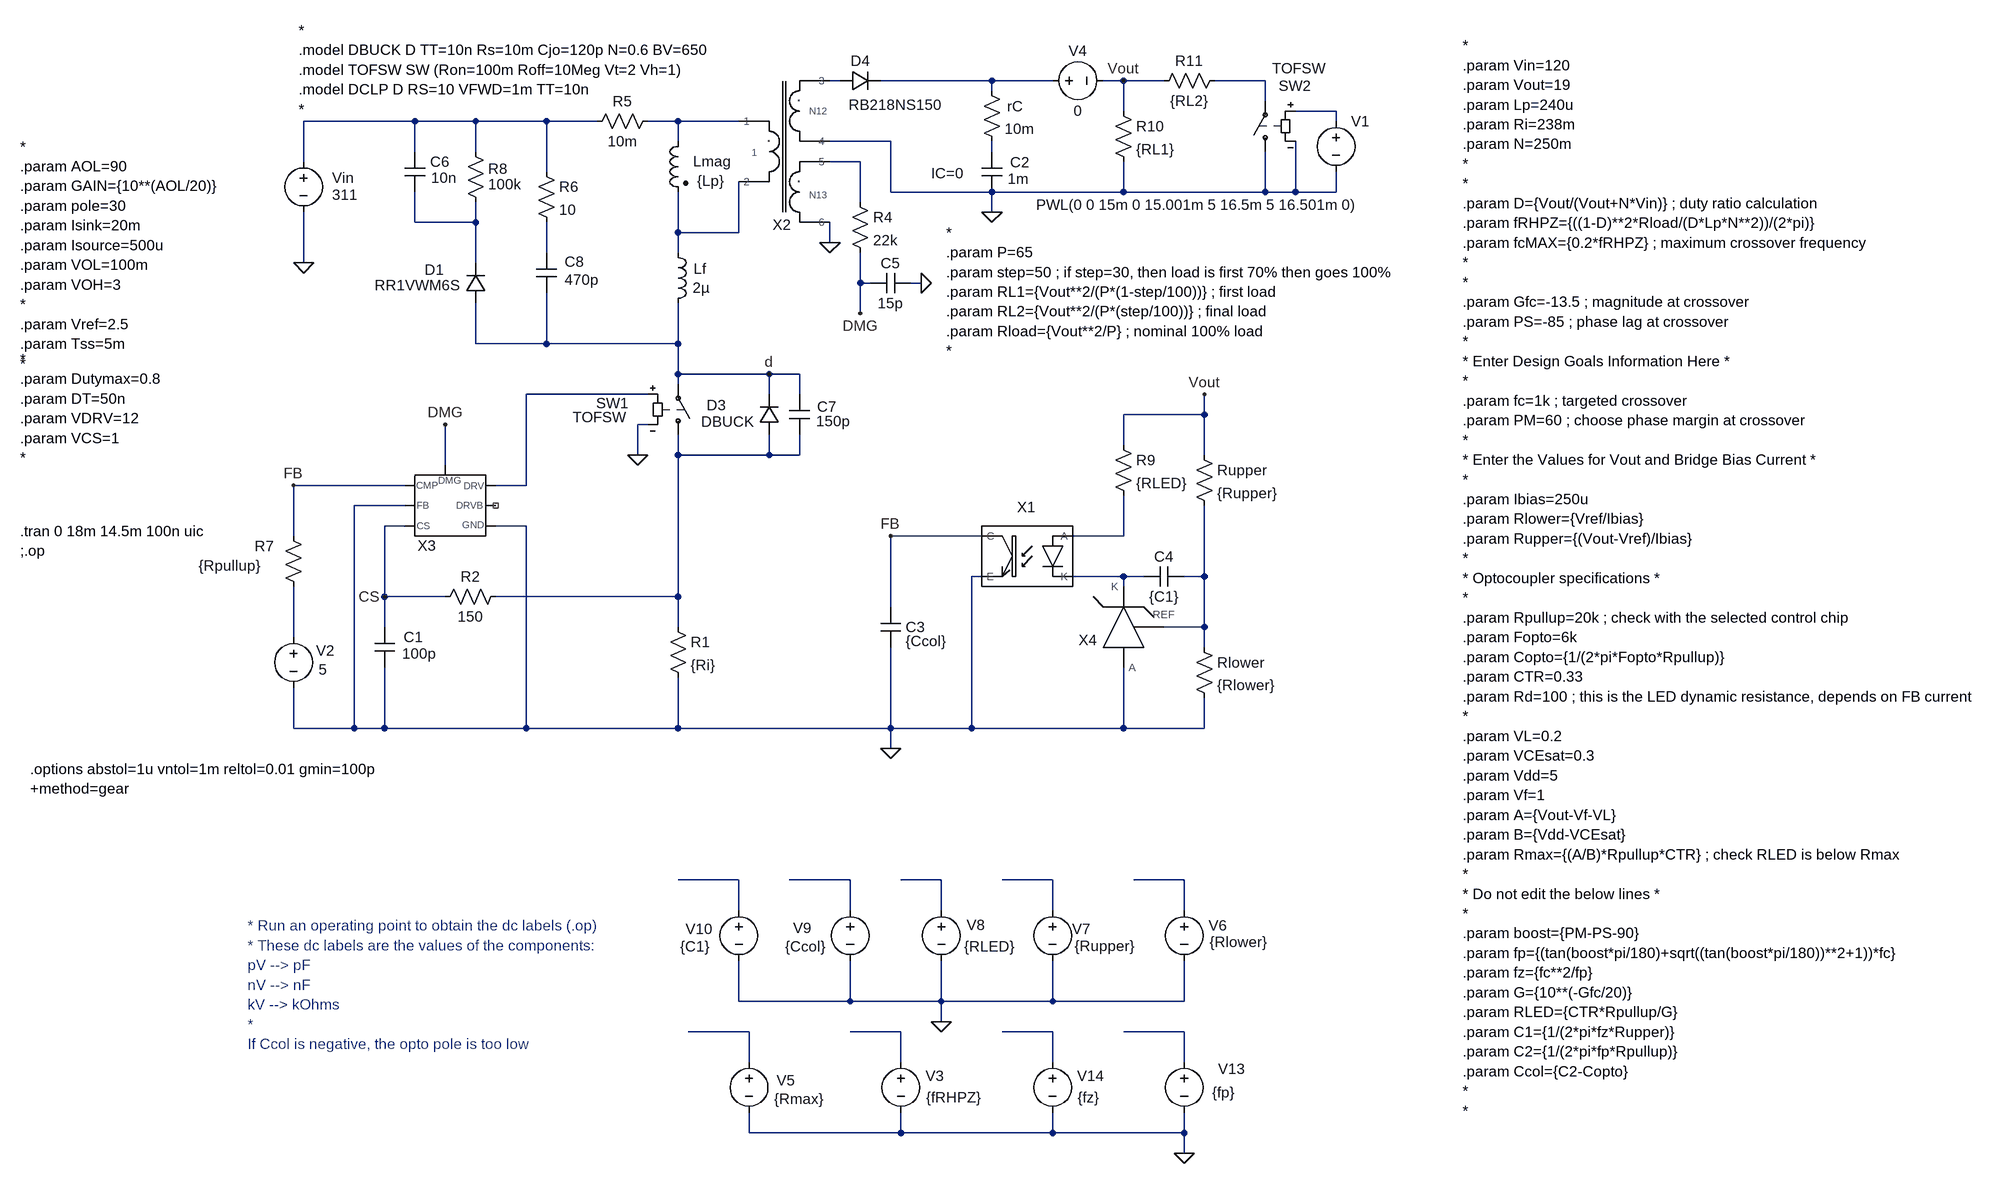
[diagram p0: schematic Flyback CM - QR - isolated - cbc - load step.asc]
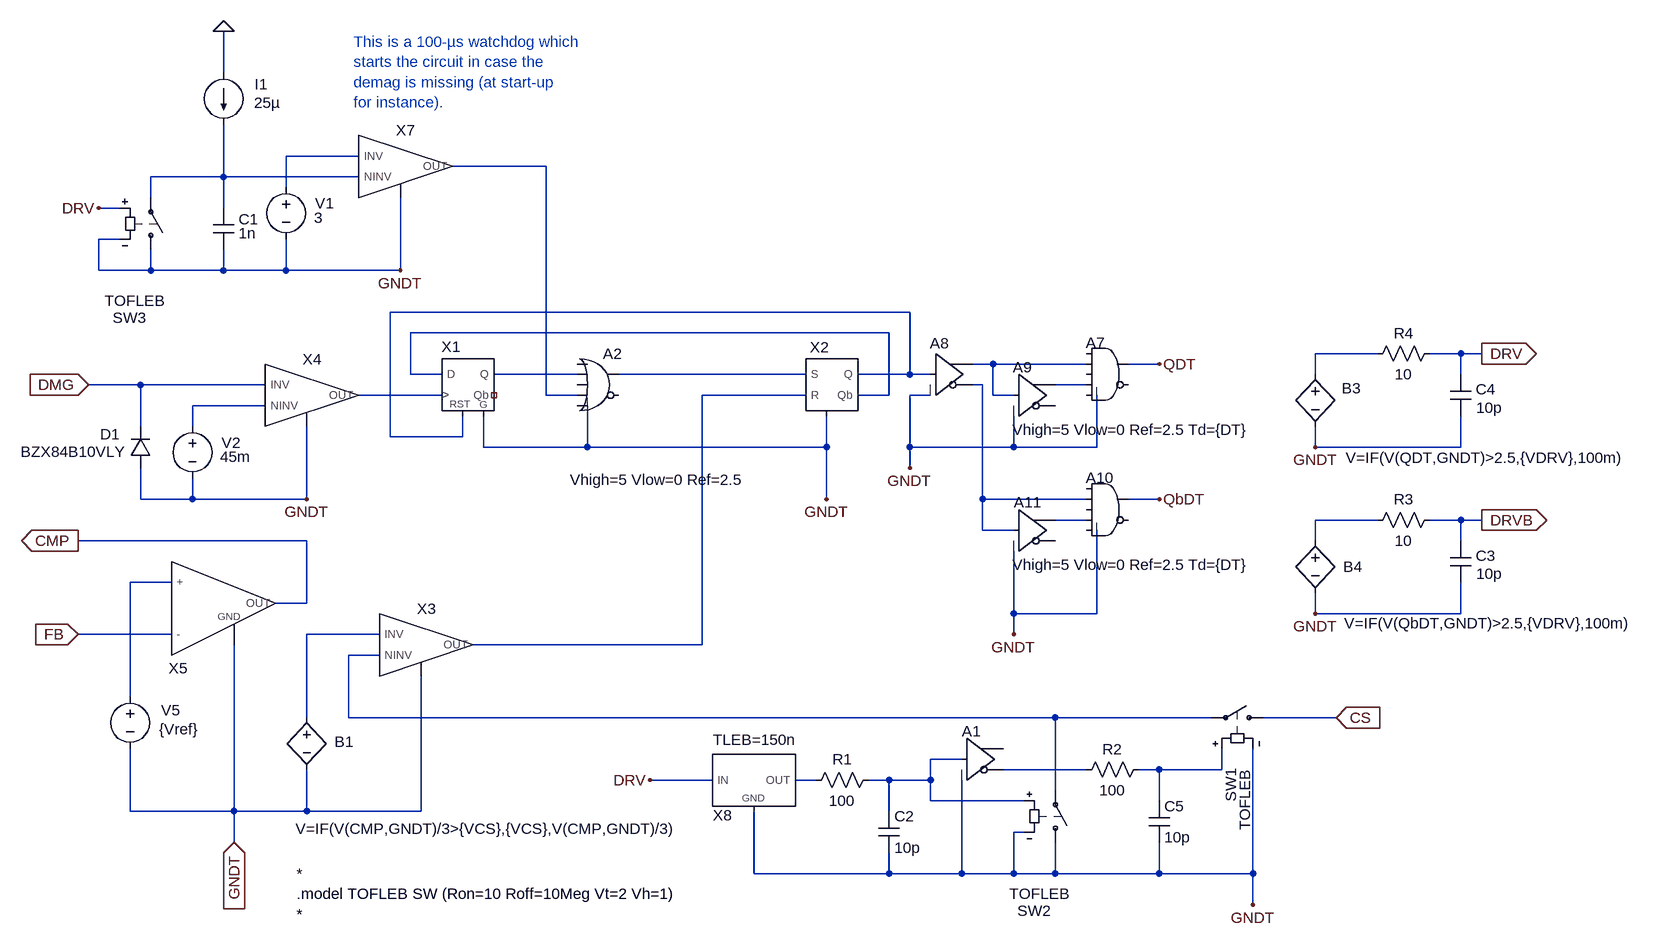
[diagram p1: sub-circuit generic_cm_qr_pwm.asc]
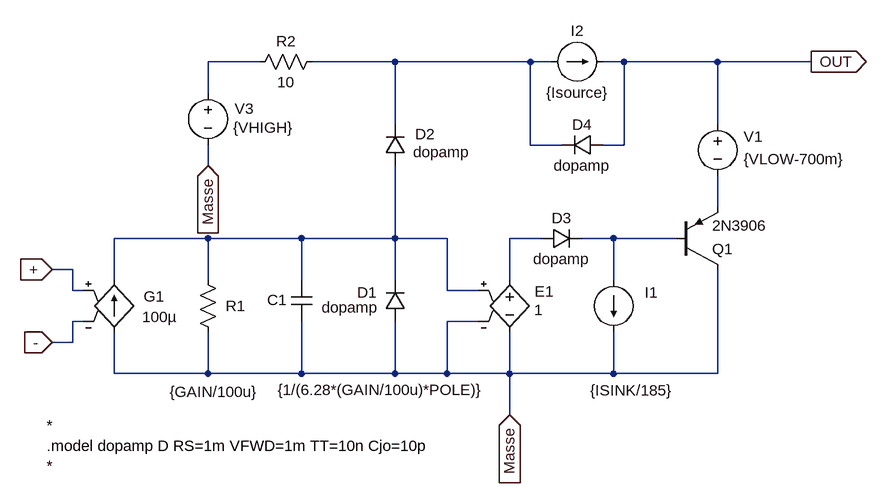
[diagram p2: sub-circuit op_amp_fan_out.asc]
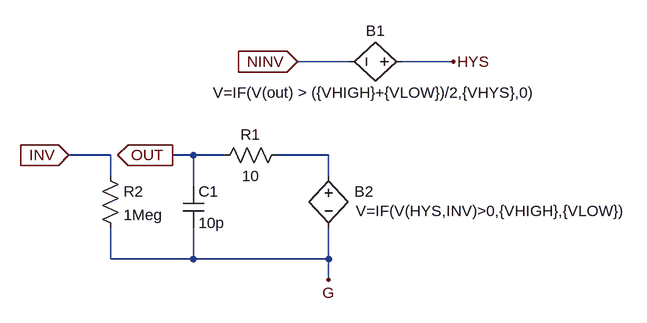
[diagram p3: sub-circuit comptof_g.asc]
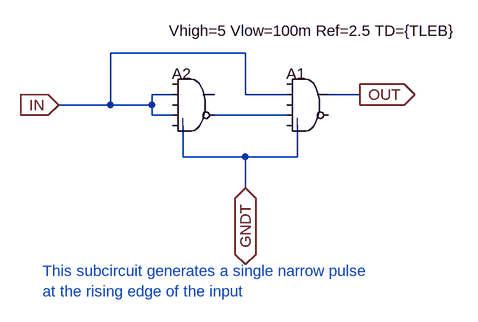
[diagram p4: sub-circuit small_pulse_leb.asc]
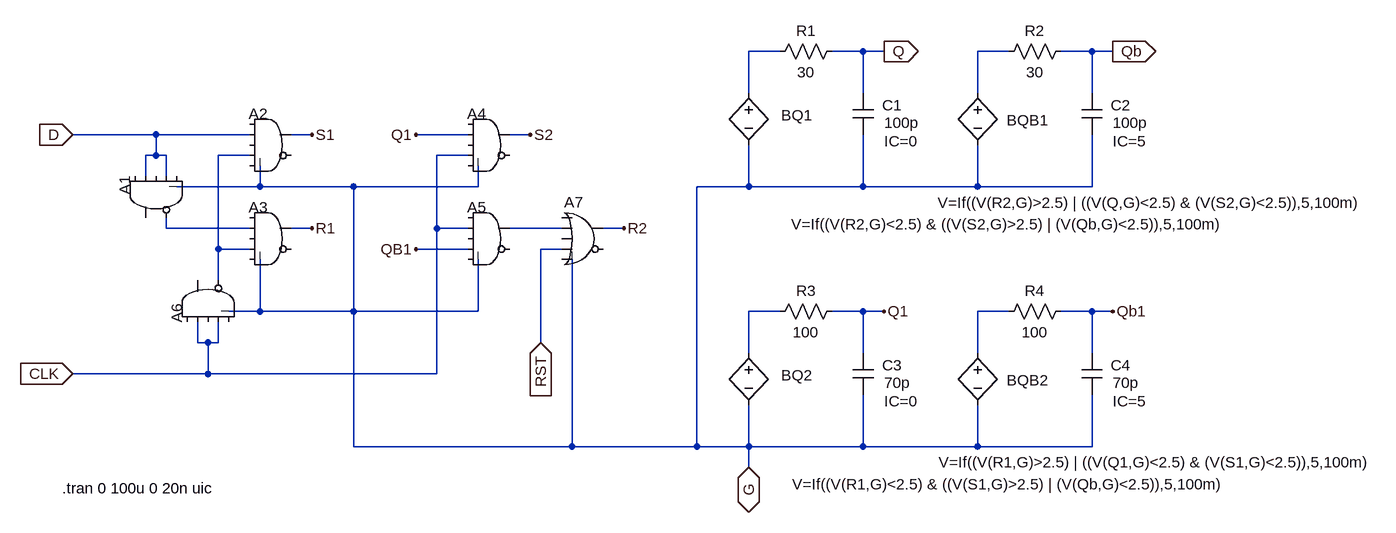
[diagram p5: sub-circuit d_flipflop_g_rst.asc]
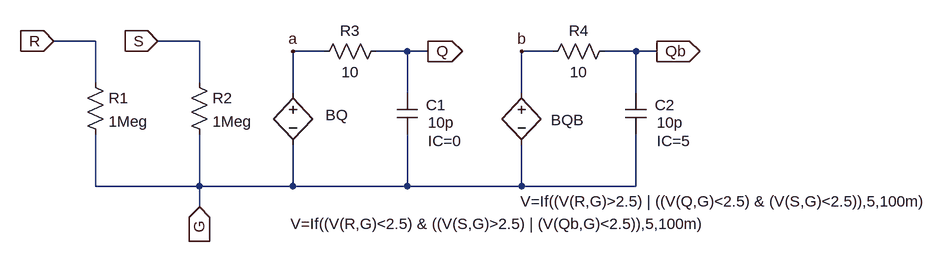
[diagram p6: sub-circuit sr_latch_g.asc]
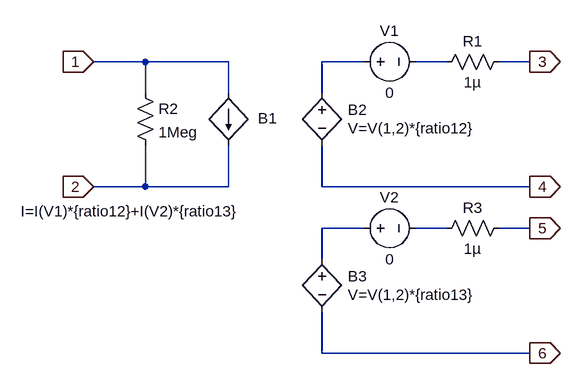
[diagram p7: sub-circuit xfmr_3w.asc]
Flyback CM - QR - isolated - cbc - load step.asc, the LTspice schematic file:
Version 4.1
SHEET 1 3452 1760
WIRE 432 -288 416 -288
WIRE 672 -288 496 -288
WIRE 768 -288 672 -288
WIRE 880 -288 848 -288
WIRE 944 -288 880 -288
WIRE 1104 -288 1024 -288
WIRE 672 -272 672 -288
WIRE 1104 -256 1104 -288
WIRE 880 -240 880 -288
WIRE 1216 -240 1152 -240
WIRE -240 -224 -416 -224
WIRE -144 -224 -240 -224
WIRE -32 -224 -144 -224
WIRE 48 -224 -32 -224
WIRE 176 -224 128 -224
WIRE 272 -224 176 -224
WIRE 1216 -224 1216 -240
WIRE 176 -192 176 -224
WIRE 512 -192 416 -192
WIRE -240 -176 -240 -224
WIRE -144 -176 -144 -224
WIRE 672 -176 672 -192
WIRE -416 -160 -416 -224
WIRE 464 -160 416 -160
WIRE -32 -144 -32 -224
WIRE 512 -112 512 -192
WIRE 672 -112 512 -112
WIRE 880 -112 880 -160
WIRE 880 -112 672 -112
WIRE 1104 -112 1104 -176
WIRE 1104 -112 880 -112
WIRE 1152 -112 1152 -192
WIRE 1152 -112 1104 -112
WIRE 1216 -112 1216 -144
WIRE 1216 -112 1152 -112
WIRE 464 -96 464 -160
WIRE 672 -80 672 -112
WIRE -240 -64 -240 -112
WIRE -144 -64 -144 -96
WIRE -144 -64 -240 -64
WIRE 176 -48 176 -112
WIRE 272 -48 272 -128
WIRE 272 -48 176 -48
WIRE 416 -32 416 -64
WIRE -32 -16 -32 -64
WIRE 176 -16 176 -48
WIRE -416 0 -416 -80
WIRE -144 0 -144 -64
WIRE 464 32 464 -16
WIRE 480 32 464 32
WIRE 560 32 544 32
WIRE 464 80 464 32
WIRE -144 128 -144 64
WIRE -32 128 -32 48
WIRE -32 128 -144 128
WIRE 176 128 176 64
WIRE 176 128 -32 128
WIRE 176 176 176 128
WIRE 320 176 176 176
WIRE 368 176 320 176
WIRE 176 192 176 176
WIRE 128 208 -64 208
WIRE 320 208 320 176
WIRE 368 208 368 176
WIRE 1008 240 1008 208
WIRE 1008 240 880 240
WIRE 128 256 112 256
WIRE 880 288 880 240
WIRE 112 304 112 256
WIRE 176 304 176 272
WIRE 320 304 320 272
WIRE 320 304 176 304
WIRE 368 304 368 272
WIRE 368 304 320 304
WIRE 1008 304 1008 240
WIRE -192 320 -192 256
WIRE -256 352 -432 352
WIRE -64 352 -64 208
WIRE -64 352 -112 352
WIRE -256 384 -336 384
WIRE -256 416 -288 416
WIRE -64 416 -112 416
WIRE -432 432 -432 352
WIRE 656 432 512 432
WIRE 880 432 880 368
WIRE 880 432 800 432
WIRE 656 496 640 496
WIRE 880 496 800 496
WIRE 912 496 880 496
WIRE 1008 496 1008 384
WIRE 1008 496 976 496
WIRE 880 512 880 496
WIRE -288 528 -288 416
WIRE -192 528 -288 528
WIRE 176 528 176 304
WIRE 176 528 -112 528
WIRE 512 544 512 432
WIRE -288 576 -288 528
WIRE 176 576 176 528
WIRE 1008 576 1008 496
WIRE 1008 576 944 576
WIRE -432 592 -432 512
WIRE 1008 608 1008 576
WIRE -432 736 -432 672
WIRE -336 736 -336 384
WIRE -336 736 -432 736
WIRE -288 736 -288 640
WIRE -288 736 -336 736
WIRE -64 736 -64 416
WIRE -64 736 -288 736
WIRE 176 736 176 656
WIRE 176 736 -64 736
WIRE 512 736 512 608
WIRE 512 736 176 736
WIRE 640 736 640 496
WIRE 640 736 512 736
WIRE 880 736 880 640
WIRE 880 736 640 736
WIRE 1008 736 1008 688
WIRE 1008 736 880 736
WIRE 512 768 512 736
WIRE 272 976 176 976
WIRE 448 976 352 976
WIRE 592 976 528 976
WIRE 768 976 688 976
WIRE 976 976 896 976
WIRE 272 1024 272 976
WIRE 448 1024 448 976
WIRE 592 1024 592 976
WIRE 768 1024 768 976
WIRE 976 1024 976 976
WIRE 272 1168 272 1104
WIRE 448 1168 448 1104
WIRE 448 1168 272 1168
WIRE 592 1168 592 1104
WIRE 592 1168 448 1168
WIRE 768 1168 768 1104
WIRE 768 1168 592 1168
WIRE 976 1168 976 1104
WIRE 976 1168 768 1168
WIRE 592 1200 592 1168
WIRE 288 1216 192 1216
WIRE 528 1216 448 1216
WIRE 768 1216 688 1216
WIRE 976 1216 880 1216
WIRE 288 1264 288 1216
WIRE 528 1264 528 1216
WIRE 768 1264 768 1216
WIRE 976 1264 976 1216
WIRE 288 1376 288 1344
WIRE 528 1376 528 1344
WIRE 528 1376 288 1376
WIRE 768 1376 768 1344
WIRE 768 1376 528 1376
WIRE 976 1376 976 1344
WIRE 976 1376 768 1376
WIRE 976 1408 976 1376
FLAG 672 -80 0
FLAG -416 0 0
FLAG 512 768 0
FLAG 1008 208 Vout
FLAG 592 1200 0
FLAG 976 1408 0
FLAG 320 176 d
FLAG 512 432 FB
FLAG -432 352 FB
FLAG 112 304 0
FLAG 416 -32 0
FLAG 464 80 DMG
FLAG -192 256 DMG
FLAG 560 32 0
FLAG 880 -288 Vout
FLAG -288 528 CS
DATAFLAG 192 976 ""
DATAFLAG 384 976 ""
DATAFLAG 560 976 ""
DATAFLAG 704 976 ""
DATAFLAG 928 976 ""
DATAFLAG 896 1216 ""
DATAFLAG 736 1216 ""
DATAFLAG 496 1216 ""
DATAFLAG 208 1216 ""
SYMBOL ind2 192 -208 M0
WINDOW 0 -69 47 Left 2
WINDOW 3 -58 78 Left 2
SYMATTR InstName Lmag
SYMATTR Value {Lp}
SYMATTR Type ind
SYMBOL sw 176 288 M180
WINDOW 3 -80 44 Right 2
WINDOW 0 -78 66 Right 2
SYMATTR Value TOFSW
SYMATTR InstName SW1
SYMBOL res 656 -288 R0
WINDOW 0 40 40 Left 2
SYMATTR InstName rC
SYMATTR Value 10m
SYMBOL cap 656 -176 R0
WINDOW 0 45 17 Left 2
WINDOW 3 41 43 Left 2
WINDOW 123 -80 34 Left 2
SYMATTR InstName C2
SYMATTR Value 1m
SYMATTR Value2 IC=0
SYMBOL voltage -416 -176 R0
WINDOW 0 45 41 Left 2
WINDOW 3 45 68 Left 2
SYMATTR InstName Vin
SYMATTR Value 311
SYMBOL res 992 592 R0
SYMATTR InstName Rlower
SYMATTR Value {Rlower}
SYMBOL res 992 288 R0
SYMATTR InstName Rupper
SYMATTR Value {Rupper}
SYMBOL voltage 976 1008 R0
WINDOW 0 39 40 Left 2
WINDOW 3 40 66 Left 2
WINDOW 123 0 0 Left 0
WINDOW 39 0 0 Left 0
SYMATTR InstName V6
SYMATTR Value {Rlower}
SYMBOL voltage 768 1008 R0
WINDOW 0 31 45 Left 2
WINDOW 3 35 72 Left 2
WINDOW 123 0 0 Left 0
WINDOW 39 0 0 Left 0
SYMATTR InstName V7
SYMATTR Value {Rupper}
SYMBOL voltage 592 1008 R0
WINDOW 0 40 39 Left 2
WINDOW 3 36 73 Left 2
WINDOW 123 0 0 Left 0
WINDOW 39 0 0 Left 0
SYMATTR InstName V8
SYMATTR Value {RLED}
SYMBOL voltage 448 1008 R0
WINDOW 0 -90 44 Left 2
WINDOW 3 -103 73 Left 2
SYMATTR InstName V9
SYMATTR Value {Ccol}
SYMBOL voltage 272 1008 R0
WINDOW 0 -84 45 Left 2
WINDOW 3 -93 73 Left 2
WINDOW 123 0 0 Left 0
WINDOW 39 0 0 Left 0
SYMATTR InstName V10
SYMATTR Value {C1}
SYMBOL voltage 976 1248 R0
WINDOW 0 54 27 Left 2
WINDOW 3 44 64 Left 2
WINDOW 123 0 0 Left 0
WINDOW 39 0 0 Left 0
SYMATTR InstName V13
SYMATTR Value {fp}
SYMBOL voltage 768 1248 R0
WINDOW 0 39 38 Left 2
WINDOW 3 40 72 Left 2
SYMATTR InstName V14
SYMATTR Value {fz}
SYMBOL res 144 -240 R90
WINDOW 0 0 56 VBottom 2
WINDOW 3 32 56 VTop 2
SYMATTR InstName R5
SYMATTR Value 10m
SYMBOL voltage 528 1248 R0
WINDOW 0 39 38 Left 2
WINDOW 3 40 72 Left 2
SYMATTR InstName V3
SYMATTR Value {fRHPZ}
SYMBOL ind 160 -32 R0
WINDOW 0 41 41 Left 2
WINDOW 3 39 71 Left 2
SYMATTR InstName Lf
SYMATTR Value 2µ
SYMBOL diode -128 64 R180
WINDOW 0 66 53 Left 2
WINDOW 3 40 29 Left 2
SYMATTR InstName D1
SYMATTR Value RR1VWM6S
SYMBOL res -160 -192 R0
WINDOW 0 36 43 Left 2
WINDOW 3 36 68 Left 2
SYMATTR InstName R8
SYMATTR Value 100k
SYMBOL cap -256 -176 R0
WINDOW 0 40 16 Left 2
WINDOW 3 42 41 Left 2
SYMATTR InstName C6
SYMATTR Value 10n
SYMBOL diode 336 272 R180
WINDOW 0 84 47 Left 2
WINDOW 3 40 21 Left 2
SYMATTR InstName D3
SYMATTR Value DBUCK
SYMBOL cap 352 208 R0
WINDOW 0 44 19 Left 2
WINDOW 3 42 42 Left 2
SYMATTR InstName C7
SYMATTR Value 150p
SYMBOL voltage -432 576 R0
WINDOW 0 36 37 Left 2
WINDOW 3 40 67 Left 2
SYMATTR InstName V2
SYMATTR Value 5
SYMBOL res -448 416 R0
WINDOW 3 -134 63 Left 2
WINDOW 0 -45 32 Left 2
SYMATTR Value {Rpullup}
SYMATTR InstName R7
SYMBOL cap 496 544 R0
WINDOW 0 40 32 Left 2
WINDOW 3 40 54 Left 2
SYMATTR InstName C3
SYMATTR Value {Ccol}
SYMBOL res 864 272 R0
SYMATTR InstName R9
SYMATTR Value {RLED}
SYMBOL cap 976 480 R90
WINDOW 0 0 32 VBottom 2
WINDOW 3 32 32 VTop 2
SYMATTR InstName C4
SYMATTR Value {C1}
SYMBOL voltage 288 1248 R0
WINDOW 0 44 45 Left 2
WINDOW 3 40 74 Left 2
WINDOW 123 0 0 Left 0
WINDOW 39 0 0 Left 0
SYMATTR InstName V5
SYMATTR Value {Rmax}
SYMBOL diode 432 -272 R270
WINDOW 0 32 32 VTop 2
WINDOW 3 -6 87 VBottom 2
SYMATTR InstName D4
SYMATTR Value RB218NS150
SYMBOL res 160 560 R0
SYMATTR InstName R1
SYMATTR Value {Ri}
SYMBOL res -96 512 R90
WINDOW 0 0 56 VBottom 2
WINDOW 3 32 56 VTop 2
SYMATTR InstName R2
SYMATTR Value 150
SYMBOL cap -304 576 R0
WINDOW 0 46 16 Left 2
WINDOW 3 44 42 Left 2
SYMATTR InstName C1
SYMATTR Value 100p
SYMBOL res 448 -112 R0
SYMATTR InstName R4
SYMATTR Value 22k
SYMBOL cap 544 16 R90
WINDOW 0 0 32 VBottom 2
WINDOW 3 32 32 VTop 2
SYMATTR InstName C5
SYMATTR Value 15p
SYMBOL res -48 -160 R0
SYMATTR InstName R6
SYMATTR Value 10
SYMBOL cap -48 -16 R0
WINDOW 0 45 14 Left 2
WINDOW 3 45 43 Left 2
SYMATTR InstName C8
SYMATTR Value 470p
SYMBOL res 864 -256 R0
SYMATTR InstName R10
SYMATTR Value {RL1}
SYMBOL res 1040 -304 R90
WINDOW 0 0 56 VBottom 2
WINDOW 3 32 56 VTop 2
SYMATTR InstName R11
SYMATTR Value {RL2}
SYMBOL sw 1104 -160 R180
WINDOW 3 -98 148 Left 2
WINDOW 0 -73 120 Left 2
SYMATTR Value TOFSW
SYMATTR InstName SW2
SYMBOL voltage 1216 -240 R0
WINDOW 3 -474 148 Left 2
WINDOW 123 0 0 Left 0
WINDOW 39 0 0 Left 0
SYMATTR Value PWL(0 0 15m 0 15.001m 5 16.5m 5 16.501m 0)
SYMATTR InstName V1
SYMBOL voltage 752 -288 R270
WINDOW 0 32 56 VTop 2
WINDOW 3 -32 56 VBottom 2
SYMATTR InstName V4
SYMATTR Value 0
SYMBOL TOF\\Subcircuits\\Generic_CM_QR_PWM -192 352 R0
WINDOW 0 -29 111 Bottom 2
SYMATTR InstName X3
SYMATTR SpiceLine gain={gain} pole={pole} Isink={Isink} Isource={Isource} Vlow={VOL} Vhigh={VOH}
SYMBOL TOF\\Subcircuits\\XFMR_3W 304 -272 R0
WINDOW 0 36 227 Bottom 2
SYMATTR InstName X2
SYMATTR SpiceLine ratio12=-250m ratio13=-200m
SYMBOL TOF\\Subcircuits\\optoTOF 688 464 M0
SYMATTR InstName X1
SYMATTR SpiceLine Copto={Copto} Rd={Rd} CTR={CTR}
SYMBOL TOF\\Subcircuits\\TL431TOF 864 528 R0
WINDOW 0 -40 84 Bottom 2
SYMATTR InstName X4
TEXT -424 -368 Left 2 !*\n.model DBUCK D TT=10n Rs=10m Cjo=120p N=0.6 BV=650\n.model TOFSW SW (Ron=100m Roff=10Meg Vt=2 Vh=1)\n.model DCLP D RS=10 VFWD=1m TT=10n\n*
TEXT -864 424 Left 2 !.tran 0 18m 14.5m 100n uic\n;.op
TEXT -848 800 Left 2 !.options abstol=1u vntol=1m reltol=0.01 gmin=100p\n+method=gear
TEXT -504 1048 Left 2 ;* Run an operating point to obtain the dc labels (.op)\n* These dc labels are the values of the components:\npV --> pF\nnV --> nF\nkV --> kOhms\n*\nIf Ccol is negative, the opto pole is too low
TEXT 1416 -344 Left 2 !*\n.param Vin=120\n.param Vout=19\n.param Lp=240u\n.param Ri=238m\n.param N=250m\n*\n*\n.param D={Vout/(Vout+N*Vin)} ; duty ratio calculation\n.param fRHPZ={((1-D)**2*Rload/(D*Lp*N**2))/(2*pi)}\n.param fcMAX={0.2*fRHPZ} ; maximum crossover frequency\n*\n*\n.param Gfc=-13.5 ; magnitude at crossover\n.param PS=-85 ; phase lag at crossover\n*\n* Enter Design Goals Information Here *\n*\n.param fc=1k ; targeted crossover\n.param PM=60 ; choose phase margin at crossover\n*\n* Enter the Values for Vout and Bridge Bias Current *\n*\n.param Ibias=250u\n.param Rlower={Vref/Ibias}\n.param Rupper={(Vout-Vref)/Ibias}\n*\n* Optocoupler specifications *\n*\n.param Rpullup=20k ; check with the selected control chip\n.param Fopto=6k\n.param Copto={1/(2*pi*Fopto*Rpullup)}\n.param CTR=0.33\n.param Rd=100 ; this is the LED dynamic resistance, depends on FB current\n*\n.param VL=0.2\n.param VCEsat=0.3\n.param Vdd=5\n.param Vf=1\n.param A={Vout-Vf-VL}\n.param B={Vdd-VCEsat}\n.param Rmax={(A/B)*Rpullup*CTR} ; check RLED is below Rmax\n*\n* Do not edit the below lines *\n*\n.param boost={PM-PS-90}\n.param fp={(tan(boost*pi/180)+sqrt((tan(boost*pi/180))**2+1))*fc}\n.param fz={fc**2/fp}\n.param G={10**(-Gfc/20)}\n.param RLED={CTR*Rpullup/G}\n.param C1={1/(2*pi*fz*Rupper)}\n.param C2={1/(2*pi*fp*Rpullup)}\n.param Ccol={C2-Copto}\n*\n*
TEXT -864 -184 Left 2 !* \n.param AOL=90\n.param GAIN={10**(AOL/20)}\n.param pole=30\n.param Isink=20m\n.param Isource=500u\n.param VOL=100m\n.param VOH=3\n*\n.param Vref=2.5\n.param Tss=5m\n*
TEXT -864 152 Left 2 !*\n.param Dutymax=0.8\n.param DT=50n\n.param VDRV=12\n.param VCS=1\n*
TEXT 600 -48 Left 2 !*\n.param P=65\n.param step=50 ; if step=30, then load is first 70% then goes 100%\n.param RL1={Vout**2/(P*(1-step/100))} ; first load\n.param RL2={Vout**2/(P*(step/100))} ; final load\n.param Rload={Vout**2/P} ; nominal 100% load\n*

generic_cm_qr_pwm.asc, the sub-circuit schematic file:
Version 4.1
SHEET 1 1744 1808
WIRE -976 384 -976 320
WIRE -768 512 -880 512
WIRE -480 528 -624 528
WIRE -976 544 -976 464
WIRE -976 544 -1088 544
WIRE -768 544 -976 544
WIRE -880 560 -880 512
WIRE -1088 576 -1088 544
WIRE -1136 592 -1168 592
WIRE -976 592 -976 544
WIRE -1136 640 -1168 640
WIRE -1168 688 -1168 640
WIRE -1088 688 -1088 656
WIRE -1088 688 -1168 688
WIRE -976 688 -976 656
WIRE -976 688 -1088 688
WIRE -880 688 -880 640
WIRE -880 688 -976 688
WIRE -704 688 -704 576
WIRE -704 688 -880 688
WIRE 80 752 -720 752
WIRE 48 784 -688 784
WIRE 800 816 704 816
WIRE 928 816 880 816
WIRE 960 816 928 816
WIRE 208 832 176 832
WIRE 352 832 208 832
WIRE 464 832 416 832
WIRE -688 848 -688 784
WIRE -640 848 -688 848
WIRE -432 848 -560 848
WIRE -80 848 -368 848
WIRE 80 848 80 752
WIRE 80 848 0 848
WIRE 112 848 80 848
WIRE 704 848 704 816
WIRE 928 848 928 816
WIRE -1104 864 -1184 864
WIRE -912 864 -1104 864
WIRE 192 864 176 864
WIRE 352 864 304 864
WIRE -640 880 -768 880
WIRE -480 880 -480 528
WIRE -432 880 -480 880
WIRE -80 880 -240 880
WIRE 48 880 48 784
WIRE 48 880 0 880
WIRE 112 880 80 880
WIRE 208 880 208 832
WIRE 240 880 208 880
WIRE -912 896 -1024 896
WIRE -1104 928 -1104 864
WIRE -1024 928 -1024 896
WIRE -720 944 -720 752
WIRE -608 944 -608 912
WIRE -608 944 -720 944
WIRE -576 960 -576 912
WIRE -416 960 -416 896
WIRE -416 960 -576 960
WIRE -48 960 -48 912
WIRE -48 960 -416 960
WIRE 80 960 80 880
WIRE 240 960 240 912
WIRE 240 960 80 960
WIRE 368 960 368 880
WIRE 368 960 240 960
WIRE 704 960 704 928
WIRE 928 960 928 912
WIRE 928 960 704 960
WIRE 80 992 80 960
WIRE -1104 1040 -1104 992
WIRE -1024 1040 -1024 1008
WIRE -1024 1040 -1104 1040
WIRE -848 1040 -848 928
WIRE -848 1040 -1024 1040
WIRE -48 1040 -48 960
WIRE 192 1040 192 864
WIRE 352 1040 192 1040
WIRE 464 1040 416 1040
WIRE 352 1072 304 1072
WIRE 800 1072 704 1072
WIRE 928 1072 880 1072
WIRE 960 1072 928 1072
WIRE 192 1088 192 1040
WIRE 240 1088 192 1088
WIRE -848 1104 -1200 1104
WIRE 704 1104 704 1072
WIRE 928 1104 928 1072
WIRE -1056 1168 -1120 1168
WIRE -848 1200 -848 1104
WIRE -848 1200 -896 1200
WIRE 240 1216 240 1120
WIRE 368 1216 368 1088
WIRE 368 1216 240 1216
WIRE 704 1216 704 1184
WIRE 928 1216 928 1168
WIRE 928 1216 704 1216
WIRE -1056 1248 -1200 1248
WIRE -736 1248 -848 1248
WIRE 240 1248 240 1216
WIRE -240 1264 -240 880
WIRE -240 1264 -592 1264
WIRE -736 1280 -784 1280
WIRE -1120 1344 -1120 1168
WIRE -848 1376 -848 1248
WIRE -784 1376 -784 1280
WIRE 304 1376 -784 1376
WIRE 544 1376 304 1376
WIRE 736 1376 624 1376
WIRE 160 1440 112 1440
WIRE 352 1456 224 1456
WIRE 464 1456 432 1456
WIRE 560 1456 560 1424
WIRE 560 1456 464 1456
WIRE -224 1472 -320 1472
WIRE -64 1472 -96 1472
WIRE 48 1472 16 1472
WIRE 112 1472 112 1440
WIRE 112 1472 48 1472
WIRE 304 1488 304 1376
WIRE 112 1504 112 1472
WIRE 256 1504 112 1504
WIRE 464 1504 464 1456
WIRE -1120 1520 -1120 1424
WIRE -960 1520 -960 1264
WIRE -960 1520 -1120 1520
WIRE -848 1520 -848 1456
WIRE -848 1520 -960 1520
WIRE -672 1520 -672 1312
WIRE -672 1520 -848 1520
WIRE 48 1520 48 1472
WIRE 256 1552 240 1552
WIRE -960 1568 -960 1520
WIRE -160 1616 -160 1520
WIRE 48 1616 48 1584
WIRE 48 1616 -160 1616
WIRE 160 1616 160 1472
WIRE 160 1616 48 1616
WIRE 240 1616 240 1552
WIRE 240 1616 160 1616
WIRE 304 1616 304 1568
WIRE 304 1616 240 1616
WIRE 464 1616 464 1568
WIRE 464 1616 304 1616
WIRE 608 1616 608 1424
WIRE 608 1616 464 1616
WIRE 608 1664 608 1616
FLAG 464 832 QDT
FLAG 464 1040 QbDT
FLAG 704 1216 GNDT
FLAG 704 960 GNDT
FLAG 960 1072 DRVB
IOPIN 960 1072 Out
FLAG 960 816 DRV
IOPIN 960 816 Out
FLAG -1200 1104 CMP
IOPIN -1200 1104 Out
FLAG -1200 1248 FB
IOPIN -1200 1248 In
FLAG 736 1376 CS
IOPIN 736 1376 In
FLAG -960 1568 GNDT
IOPIN -960 1568 In
FLAG 240 1248 GNDT
FLAG 80 992 GNDT
FLAG -48 1040 GNDT
FLAG -1184 864 DMG
IOPIN -1184 864 In
FLAG -848 1040 GNDT
FLAG 608 1664 GNDT
FLAG -320 1472 DRV
FLAG -704 688 GNDT
FLAG -976 320 0
FLAG -1168 592 DRV
SYMBOL Digital\\and 384 784 R0
WINDOW 0 -33 15 Left 2
SYMATTR InstName A7
SYMATTR SpiceLine Vhigh=5 Vlow=0 Ref=2.5
SYMBOL Digital\\buf 112 784 R0
WINDOW 0 -1 16 Left 2
SYMATTR InstName A8
SYMATTR SpiceLine Vhigh=5 Vlow=0 Ref=1.0
SYMBOL Digital\\buf 240 816 R0
WINDOW 0 -1 21 Left 2
WINDOW 39 -2 117 Left 2
SYMATTR InstName A9
SYMATTR SpiceLine Vhigh=5 Vlow=0 Ref=2.5 Td={DT}
SYMBOL Digital\\and 384 992 R0
WINDOW 0 -33 15 Left 2
SYMATTR InstName A10
SYMATTR SpiceLine Vhigh=5 Vlow=0 Ref=2.5
SYMBOL Digital\\buf 240 1024 R0
WINDOW 0 0 21 Left 2
WINDOW 39 -2 117 Left 2
SYMATTR InstName A11
SYMATTR SpiceLine Vhigh=5 Vlow=0 Ref=2.5 Td={DT}
SYMBOL bv 704 832 R0
WINDOW 0 41 37 Left 2
WINDOW 3 47 144 Left 2
SYMATTR InstName B3
SYMATTR Value V=IF(V(QDT,GNDT)>2.5,{VDRV},100m)
SYMBOL bv 704 1088 R0
WINDOW 0 43 56 Left 2
WINDOW 3 45 143 Left 2
SYMATTR InstName B4
SYMATTR Value V=IF(V(QbDT,GNDT)>2.5,{VDRV},100m)
SYMBOL res 896 1056 R90
WINDOW 0 0 56 VBottom 2
WINDOW 3 32 56 VTop 2
SYMATTR InstName R3
SYMATTR Value 10
SYMBOL cap 912 1104 R0
WINDOW 0 39 23 Left 2
WINDOW 3 40 51 Left 2
SYMATTR InstName C3
SYMATTR Value 10p
SYMBOL res 896 800 R90
WINDOW 0 0 56 VBottom 2
WINDOW 3 32 56 VTop 2
SYMATTR InstName R4
SYMATTR Value 10
SYMBOL cap 912 848 R0
WINDOW 0 39 23 Left 2
WINDOW 3 40 51 Left 2
SYMATTR InstName C4
SYMATTR Value 10p
SYMBOL op_amp_fan_out -976 1200 R0
WINDOW 0 -70 116 Bottom 2
SYMATTR InstName X5
SYMATTR SpiceLine gain={gain} pole={pole} Isink={Isink} Isource={Isource} Vlow={VOL} Vhigh={VOH}
SYMBOL voltage -1120 1328 R0
WINDOW 0 48 37 Left 2
WINDOW 3 45 66 Left 2
SYMATTR InstName V5
SYMATTR Value {Vref}
SYMBOL bv -848 1360 R0
WINDOW 0 43 53 Left 2
WINDOW 3 -17 187 Left 2
SYMATTR InstName B1
SYMATTR Value V=IF(V(CMP,GNDT)/3>{VCS},{VCS},V(CMP,GNDT)/3)
SYMBOL voltage -1024 912 R0
WINDOW 0 45 41 Left 2
WINDOW 3 43 63 Left 2
SYMATTR InstName V2
SYMATTR Value 45m
SYMBOL diode -1088 992 R180
WINDOW 0 47 52 Left 2
WINDOW 3 39 25 Left 2
SYMATTR InstName D1
SYMATTR Value BZX84B10VLY
SYMBOL sw 640 1376 M270
WINDOW 3 -80 44 Right 2
WINDOW 0 -78 66 Right 2
SYMATTR Value TOFLEB
SYMATTR InstName SW1
SYMBOL sw 304 1584 M180
WINDOW 3 23 -63 Right 2
WINDOW 0 -7 -89 Right 2
SYMATTR Value TOFLEB
SYMATTR InstName SW2
SYMBOL Digital\\buf 160 1376 R0
WINDOW 0 0 21 Left 2
SYMATTR InstName A1
SYMATTR SpiceLine Vhigh=5 Vlow=0 Ref=2.5
SYMBOL voltage -880 544 R0
WINDOW 0 45 41 Left 2
WINDOW 3 43 63 Left 2
SYMATTR InstName V1
SYMATTR Value 3
SYMBOL current -976 384 R0
WINDOW 0 48 18 Left 2
WINDOW 3 47 46 Left 2
SYMATTR InstName I1
SYMATTR Value 25µ
SYMBOL cap -992 592 R0
WINDOW 0 39 17 Left 2
WINDOW 3 39 39 Left 2
SYMATTR InstName C1
SYMATTR Value 1n
SYMBOL sw -1088 672 M180
WINDOW 3 23 -63 Right 2
WINDOW 0 -7 -89 Right 2
SYMATTR Value TOFLEB
SYMATTR InstName SW3
SYMBOL Digital\\or -400 800 R0
WINDOW 39 -43 210 Left 2
SYMATTR SpiceLine Vhigh=5 Vlow=0 Ref=2.5
SYMATTR InstName A2
SYMBOL TOF\\Subcircuits\\COMPTOF_G -704 528 R0
SYMATTR InstName X7
SYMATTR SpiceLine VHIGH=5 VLOW=100m VHYS=10m
SYMBOL TOF\\Subcircuits\\COMPTOF_G -848 880 R0
SYMATTR InstName X4
SYMATTR SpiceLine VHIGH=5 VLOW=100m VHYS=10m
SYMBOL TOF\\Subcircuits\\COMPTOF_G -672 1264 R0
SYMATTR InstName X3
SYMATTR SpiceLine VHIGH=5 VLOW=100m VHYS=10m
SYMBOL TOF\\Subcircuits\\Small_pulse_LEB -160 1472 R0
WINDOW 0 -48 70 Bottom 2
WINDOW 39 1 -46 Bottom 2
SYMATTR InstName X8
SYMATTR SpiceLine TLEB=150n
SYMBOL res 32 1456 R90
WINDOW 0 0 56 VBottom 2
WINDOW 3 32 56 VTop 2
SYMATTR InstName R1
SYMATTR Value 100
SYMBOL cap 32 1520 R0
SYMATTR InstName C2
SYMATTR Value 10p
SYMBOL res 448 1440 R90
WINDOW 0 0 56 VBottom 2
WINDOW 3 32 56 VTop 2
SYMATTR InstName R2
SYMATTR Value 100
SYMBOL cap 448 1504 R0
SYMATTR InstName C5
SYMATTR Value 10p
SYMBOL TOF\\Subcircuits\\D_FlipFlop_G_RST -608 864 R0
WINDOW 0 -18 -43 Bottom 2
SYMATTR InstName X1
SYMBOL TOF\\Subcircuits\\SR_latch_G -48 864 R0
WINDOW 0 -11 -42 Bottom 2
SYMATTR InstName X2
TEXT -864 1616 Left 2 !*\n.model TOFLEB SW (Ron=10 Roff=10Meg Vt=2 Vh=1)\n*
TEXT -776 336 Left 2 ;This is a 100-µs watchdog which\nstarts the circuit in case the\ndemag is missing (at start-up\nfor instance).

op_amp_fan_out.asc, the sub-circuit schematic file:
Version 4.1
SHEET 1 1504 680
WIRE 96 -224 16 -224
WIRE 304 -224 176 -224
WIRE 512 -224 304 -224
WIRE 544 -224 512 -224
WIRE 656 -224 624 -224
WIRE 800 -224 656 -224
WIRE 944 -224 800 -224
WIRE 16 -176 16 -224
WIRE 304 -128 304 -224
WIRE 800 -128 800 -224
WIRE 512 -96 512 -224
WIRE 560 -96 512 -96
WIRE 656 -96 656 -224
WIRE 656 -96 624 -96
WIRE 16 -64 16 -96
WIRE 800 0 800 -48
WIRE 16 48 -128 48
WIRE 160 48 16 48
WIRE 304 48 304 -64
WIRE 304 48 160 48
WIRE 384 48 304 48
WIRE 528 48 480 48
WIRE 640 48 592 48
WIRE 736 48 640 48
WIRE -192 96 -224 96
WIRE -128 112 -128 48
WIRE 16 112 16 48
WIRE 160 112 160 48
WIRE 304 112 304 48
WIRE 480 112 480 48
WIRE 640 112 640 48
WIRE -192 128 -192 96
WIRE -176 128 -192 128
WIRE 384 128 384 48
WIRE 432 128 384 128
WIRE -176 176 -192 176
WIRE 432 176 384 176
WIRE -192 208 -192 176
WIRE -192 208 -224 208
WIRE -128 256 -128 192
WIRE 16 256 16 192
WIRE 16 256 -128 256
WIRE 160 256 160 176
WIRE 160 256 16 256
WIRE 304 256 304 176
WIRE 304 256 160 256
WIRE 384 256 384 176
WIRE 384 256 304 256
WIRE 480 256 480 192
WIRE 480 256 384 256
WIRE 640 256 640 192
WIRE 640 256 480 256
WIRE 800 256 800 96
WIRE 800 256 640 256
WIRE 480 320 480 256
FLAG -224 96 +
IOPIN -224 96 In
FLAG -224 208 -
IOPIN -224 208 In
FLAG 944 -224 OUT
IOPIN 944 -224 Out
FLAG 480 320 Masse
IOPIN 480 320 In
FLAG 16 -64 Masse
IOPIN 16 -64 In
DATAFLAG 800 -16 ""
SYMBOL g -128 96 R0
WINDOW 0 45 41 Left 2
WINDOW 3 43 73 Left 2
SYMATTR InstName G1
SYMATTR Value 100µ
SYMBOL res 0 96 R0
WINDOW 0 43 56 Left 2
WINDOW 3 -43 188 Left 2
SYMATTR InstName R1
SYMATTR Value {GAIN/100u}
SYMBOL cap 144 112 R0
WINDOW 0 -37 31 Left 2
WINDOW 3 -21 169 Left 2
SYMATTR InstName C1
SYMATTR Value {1/(6.28*(GAIN/100u)*POLE)}
SYMBOL diode 320 176 R180
WINDOW 0 44 45 Left 2
WINDOW 3 41 22 Left 2
SYMATTR InstName D1
SYMATTR Value dopamp
SYMBOL e 480 96 R0
WINDOW 0 39 34 Left 2
WINDOW 3 38 62 Left 2
SYMATTR InstName E1
SYMATTR Value 1
SYMBOL diode 528 64 R270
WINDOW 0 32 32 VTop 2
WINDOW 3 0 32 VBottom 2
SYMATTR InstName D3
SYMATTR Value dopamp
SYMBOL current 640 112 R0
WINDOW 0 48 19 Left 2
WINDOW 3 -36 170 Left 2
SYMATTR InstName I1
SYMATTR Value {ISINK/185}
SYMBOL pnp 736 96 M180
SYMATTR InstName Q1
SYMATTR Value 2N3906
SYMBOL voltage 800 -144 R0
WINDOW 0 40 35 Left 2
WINDOW 3 40 70 Left 2
SYMATTR InstName V1
SYMATTR Value {VLOW-700m}
SYMBOL current 544 -224 R270
WINDOW 0 32 40 VTop 2
WINDOW 3 -32 40 VBottom 2
SYMATTR InstName I2
SYMATTR Value {Isource}
SYMBOL diode 624 -80 M270
WINDOW 0 32 32 VTop 2
WINDOW 3 0 32 VBottom 2
SYMATTR InstName D4
SYMATTR Value dopamp
SYMBOL voltage 16 -192 R0
WINDOW 0 41 40 Left 2
WINDOW 3 39 69 Left 2
SYMATTR InstName V3
SYMATTR Value {VHIGH}
SYMBOL diode 288 -64 M180
WINDOW 0 47 49 Left 2
WINDOW 3 44 21 Left 2
SYMATTR InstName D2
SYMATTR Value dopamp
SYMBOL res 192 -240 R90
WINDOW 0 0 56 VBottom 2
WINDOW 3 32 56 VTop 2
SYMATTR InstName R2
SYMATTR Value 10
TEXT -232 336 Left 2 !*\n.model dopamp D RS=1m VFWD=1m TT=10n Cjo=10p\n*

comptof_g.asc, the sub-circuit schematic file:
Version 4.1
SHEET 1 880 680
WIRE 64 192 -16 192
WIRE 224 192 144 192
WIRE -304 336 -368 336
WIRE -176 336 -208 336
WIRE -128 336 -176 336
WIRE 32 336 -48 336
WIRE -304 368 -304 336
WIRE 32 368 32 336
WIRE -176 384 -176 336
WIRE -304 496 -304 448
WIRE -176 496 -176 448
WIRE -176 496 -304 496
WIRE 32 496 32 448
WIRE 32 496 -176 496
WIRE 32 528 32 496
FLAG -16 192 NINV
IOPIN -16 192 In
FLAG 224 192 HYS
FLAG -208 336 OUT
IOPIN -208 336 Out
FLAG -368 336 INV
IOPIN -368 336 In
FLAG 32 528 G
SYMBOL bv 160 192 R90
WINDOW 0 -32 56 VBottom 2
WINDOW 3 32 56 VTop 2
SYMATTR InstName B1
SYMATTR Value V=IF(V(out) > ({VHIGH}+{VLOW})/2,{VHYS},0)
SYMBOL bv 32 352 R0
WINDOW 0 40 40 Left 2
WINDOW 3 42 70 Left 2
SYMATTR InstName B2
SYMATTR Value V=IF(V(HYS,INV)>0,{VHIGH},{VLOW})
SYMBOL res -32 320 R90
WINDOW 0 0 56 VBottom 2
WINDOW 3 32 56 VTop 2
SYMATTR InstName R1
SYMATTR Value 10
SYMBOL cap -192 384 R0
SYMATTR InstName C1
SYMATTR Value 10p
SYMBOL res -320 352 R0
SYMATTR InstName R2
SYMATTR Value 1Meg

small_pulse_leb.asc, the sub-circuit schematic file:
Version 4.1
SHEET 1 880 680
WIRE 16 64 -192 64
WIRE -96 128 -128 128
WIRE 16 128 16 64
WIRE 80 128 16 128
WIRE 192 128 144 128
WIRE -192 144 -192 64
WIRE -192 144 -272 144
WIRE -128 144 -128 128
WIRE -128 144 -192 144
WIRE -128 160 -128 144
WIRE -96 160 -128 160
WIRE 80 160 -32 160
WIRE -80 224 -80 176
WIRE 16 224 -80 224
WIRE 96 224 96 176
WIRE 96 224 16 224
WIRE 16 272 16 224
FLAG 16 272 GNDT
IOPIN 16 272 BiDir
FLAG 192 128 OUT
IOPIN 192 128 Out
FLAG -272 144 IN
IOPIN -272 144 In
SYMBOL Digital\\and 112 80 R0
WINDOW 0 -33 16 Left 2
SYMATTR InstName A1
SYMATTR SpiceLine Vhigh=5 Vlow=100m Ref=2.5
SYMBOL Digital\\and -64 80 R0
WINDOW 0 -33 16 Left 2
WINDOW 39 -38 -50 Left 2
SYMATTR InstName A2
SYMATTR SpiceLine Vhigh=5 Vlow=100m Ref=2.5 TD={TLEB}
TEXT -296 400 Left 2 ;This subcircuit generates a single narrow pulse\nat the rising edge of the input

d_flipflop_g_rst.asc, the sub-circuit schematic file:
Version 4.1
SHEET 1 1472 916
WIRE 480 -288 432 -288
WIRE 608 -288 560 -288
WIRE 640 -288 608 -288
WIRE 832 -288 784 -288
WIRE 960 -288 912 -288
WIRE 992 -288 960 -288
WIRE 432 -224 432 -288
WIRE 608 -224 608 -288
WIRE 784 -224 784 -288
WIRE 960 -224 960 -288
WIRE -480 -160 -608 -160
WIRE -336 -160 -480 -160
WIRE -240 -160 -272 -160
WIRE 0 -160 -80 -160
WIRE 96 -160 64 -160
WIRE -480 -128 -480 -160
WIRE -480 -128 -496 -128
WIRE -464 -128 -480 -128
WIRE -336 -128 -384 -128
WIRE 0 -128 -48 -128
WIRE -496 -96 -496 -128
WIRE -464 -96 -464 -128
WIRE -320 -80 -320 -112
WIRE -320 -80 -448 -80
WIRE -176 -80 -320 -80
WIRE 16 -80 16 -112
WIRE 16 -80 -176 -80
WIRE 432 -80 432 -144
WIRE 432 -80 352 -80
WIRE 608 -80 608 -160
WIRE 608 -80 432 -80
WIRE 784 -80 784 -144
WIRE 784 -80 608 -80
WIRE 960 -80 960 -160
WIRE 960 -80 784 -80
WIRE -464 -16 -464 -32
WIRE -336 -16 -464 -16
WIRE -240 -16 -272 -16
WIRE -48 -16 -48 -128
WIRE 0 -16 -48 -16
WIRE 144 -16 64 -16
WIRE 240 -16 208 -16
WIRE -384 16 -384 -128
WIRE -336 16 -384 16
WIRE 0 16 -80 16
WIRE 144 16 112 16
WIRE -384 64 -384 16
WIRE -320 112 -320 32
WIRE -320 112 -368 112
WIRE -176 112 -176 -80
WIRE -176 112 -320 112
WIRE 16 112 16 32
WIRE 16 112 -176 112
WIRE 480 112 432 112
WIRE 608 112 560 112
WIRE 640 112 608 112
WIRE 832 112 784 112
WIRE 960 112 912 112
WIRE 992 112 960 112
WIRE -416 160 -416 128
WIRE -400 160 -416 160
WIRE -384 160 -384 128
WIRE -384 160 -400 160
WIRE 112 160 112 16
WIRE 432 176 432 112
WIRE 608 176 608 112
WIRE 784 176 784 112
WIRE 960 176 960 112
WIRE -400 208 -400 160
WIRE -400 208 -608 208
WIRE -48 208 -48 -16
WIRE -48 208 -400 208
WIRE -176 320 -176 112
WIRE 160 320 160 32
WIRE 160 320 -176 320
WIRE 352 320 352 -80
WIRE 352 320 160 320
WIRE 432 320 432 256
WIRE 432 320 352 320
WIRE 608 320 608 240
WIRE 608 320 432 320
WIRE 784 320 784 256
WIRE 784 320 608 320
WIRE 960 320 960 240
WIRE 960 320 784 320
WIRE 432 352 432 320
FLAG -608 -160 D
IOPIN -608 -160 In
FLAG -608 208 CLK
IOPIN -608 208 In
FLAG 96 -160 S2
FLAG 240 -16 R2
FLAG 640 -288 Q
IOPIN 640 -288 Out
FLAG 992 -288 Qb
IOPIN 992 -288 Out
FLAG -240 -160 S1
FLAG -240 -16 R1
FLAG -80 -160 Q1
FLAG -80 16 QB1
FLAG 640 112 Q1
FLAG 992 112 Qb1
FLAG 432 352 G
IOPIN 432 352 BiDir
FLAG 112 160 RST
IOPIN 112 160 In
SYMBOL Digital\\and -544 -64 M90
WINDOW 0 -33 16 Left 2
SYMATTR InstName A1
SYMATTR SpiceLine Vhigh=5 Vlow=100m Ref=2.5 TD=10n
SYMBOL bv 432 -240 R0
WINDOW 0 50 50 Left 2
WINDOW 3 65 218 Left 2
SYMATTR InstName BQ1
SYMATTR Value V=If((V(R2,G)<2.5) & ((V(S2,G)>2.5) | (V(Qb,G)<2.5)),5,100m)
SYMBOL res 576 -304 R90
WINDOW 0 0 56 VBottom 2
WINDOW 3 32 56 VTop 2
SYMATTR InstName R1
SYMATTR Value 30
SYMBOL cap 592 -224 R0
WINDOW 0 45 19 Left 2
WINDOW 3 48 46 Left 2
WINDOW 123 48 74 Left 2
SYMATTR InstName C1
SYMATTR Value 100p
SYMATTR Value2 IC=0
SYMBOL bv 784 -240 R0
WINDOW 0 45 58 Left 2
WINDOW 3 -61 185 Left 2
SYMATTR InstName BQB1
SYMATTR Value V=If((V(R2,G)>2.5) | ((V(Q,G)<2.5) & (V(S2,G)<2.5)),5,100m)
SYMBOL res 928 -304 R90
WINDOW 0 0 56 VBottom 2
WINDOW 3 32 56 VTop 2
SYMATTR InstName R2
SYMATTR Value 30
SYMBOL cap 944 -224 R0
WINDOW 0 45 19 Left 2
WINDOW 3 48 46 Left 2
WINDOW 123 48 74 Left 2
SYMATTR InstName C2
SYMATTR Value 100p
SYMATTR Value2 IC=5
SYMBOL bv 432 160 R0
WINDOW 0 50 50 Left 2
WINDOW 3 67 218 Left 2
SYMATTR InstName BQ2
SYMATTR Value V=If((V(R1,G)<2.5) & ((V(S1,G)>2.5) | (V(Qb,G)<2.5)),5,100m)
SYMBOL res 576 96 R90
WINDOW 0 0 56 VBottom 2
WINDOW 3 32 56 VTop 2
SYMATTR InstName R3
SYMATTR Value 100
SYMBOL cap 592 176 R0
WINDOW 0 45 19 Left 2
WINDOW 3 48 46 Left 2
WINDOW 123 48 74 Left 2
SYMATTR InstName C3
SYMATTR Value 70p
SYMATTR Value2 IC=0
SYMBOL bv 784 160 R0
WINDOW 0 45 58 Left 2
WINDOW 3 -60 184 Left 2
SYMATTR InstName BQB2
SYMATTR Value V=If((V(R1,G)>2.5) | ((V(Q1,G)<2.5) & (V(S1,G)<2.5)),5,100m)
SYMBOL res 928 96 R90
WINDOW 0 0 56 VBottom 2
WINDOW 3 32 56 VTop 2
SYMATTR InstName R4
SYMATTR Value 100
SYMBOL cap 944 176 R0
WINDOW 0 45 19 Left 2
WINDOW 3 48 46 Left 2
WINDOW 123 48 74 Left 2
SYMATTR InstName C4
SYMATTR Value 70p
SYMATTR Value2 IC=5
SYMBOL Digital\\and -304 -208 R0
WINDOW 0 -33 16 Left 2
SYMATTR InstName A2
SYMATTR SpiceLine Vhigh=5 Vlow=100m Ref=2.5 TD=10n
SYMBOL Digital\\and -304 -64 R0
WINDOW 0 -33 16 Left 2
SYMATTR InstName A3
SYMATTR SpiceLine Vhigh=5 Vlow=100m Ref=2.5 TD=10n
SYMBOL Digital\\and 32 -208 R0
WINDOW 0 -33 16 Left 2
SYMATTR InstName A4
SYMATTR SpiceLine Vhigh=5 Vlow=100m Ref=2.5 TD=10n
SYMBOL Digital\\and 32 -64 R0
WINDOW 0 -33 16 Left 2
SYMATTR InstName A5
SYMATTR SpiceLine Vhigh=5 Vlow=100m Ref=2.5 TD=10n
SYMBOL Digital\\and -464 96 R270
WINDOW 0 -33 16 Left 2
SYMATTR InstName A6
SYMATTR SpiceLine Vhigh=5 Vlow=100m Ref=2.5 TD=10n
SYMBOL Digital\\or 176 -64 R0
WINDOW 0 -28 8 Left 2
SYMATTR InstName A7
SYMATTR SpiceLine Vhigh=5 Vlow=0 Ref=2.5
TEXT -624 384 Left 2 !.tran 0 100u 0 20n uic

sr_latch_g.asc, the sub-circuit schematic file:
Version 4.1
SHEET 1 1168 680
WIRE -192 48 -256 48
WIRE -32 48 -96 48
WIRE 160 64 112 64
WIRE 288 64 240 64
WIRE 320 64 288 64
WIRE 512 64 464 64
WIRE 640 64 592 64
WIRE 672 64 640 64
WIRE -192 112 -192 48
WIRE -32 112 -32 48
WIRE 112 128 112 64
WIRE 288 128 288 64
WIRE 464 128 464 64
WIRE 640 128 640 64
WIRE -192 272 -192 192
WIRE -32 272 -32 192
WIRE -32 272 -192 272
WIRE 112 272 112 208
WIRE 112 272 -32 272
WIRE 288 272 288 192
WIRE 288 272 112 272
WIRE 464 272 464 208
WIRE 464 272 288 272
WIRE 640 272 640 192
WIRE 640 272 464 272
WIRE -32 304 -32 272
FLAG -256 48 R
IOPIN -256 48 In
FLAG -96 48 S
IOPIN -96 48 In
FLAG 320 64 Q
IOPIN 320 64 Out
FLAG 672 64 Qb
IOPIN 672 64 Out
FLAG 112 64 a
FLAG 464 64 b
FLAG -32 304 G
IOPIN -32 304 In
SYMBOL bv 112 112 R0
WINDOW 0 50 50 Left 2
WINDOW 3 -4 218 Left 2
SYMATTR InstName BQ
SYMATTR Value V=If((V(R,G)<2.5) & ((V(S,G)>2.5) | (V(Qb,G)<2.5)),5,100m)
SYMBOL res -208 96 R0
SYMATTR InstName R1
SYMATTR Value 1Meg
SYMBOL res -48 96 R0
SYMATTR InstName R2
SYMATTR Value 1Meg
SYMBOL res 256 48 R90
WINDOW 0 0 56 VBottom 2
WINDOW 3 32 56 VTop 2
SYMATTR InstName R3
SYMATTR Value 10
SYMBOL cap 272 128 R0
WINDOW 0 45 19 Left 2
WINDOW 3 48 46 Left 2
WINDOW 123 48 74 Left 2
SYMATTR InstName C1
SYMATTR Value 10p
SYMATTR Value2 IC=0
SYMBOL bv 464 112 R0
WINDOW 0 45 58 Left 2
WINDOW 3 -2 183 Left 2
SYMATTR InstName BQB
SYMATTR Value V=If((V(R,G)>2.5) | ((V(Q,G)<2.5) & (V(S,G)<2.5)),5,100m)
SYMBOL res 608 48 R90
WINDOW 0 0 56 VBottom 2
WINDOW 3 32 56 VTop 2
SYMATTR InstName R4
SYMATTR Value 10
SYMBOL cap 624 128 R0
WINDOW 0 45 19 Left 2
WINDOW 3 48 46 Left 2
WINDOW 123 48 74 Left 2
SYMATTR InstName C2
SYMATTR Value 10p
SYMATTR Value2 IC=5

xfmr_3w.asc, the sub-circuit schematic file:
Version 4.1
SHEET 1 880 680
WIRE 32 96 -48 96
WIRE 160 96 32 96
WIRE 368 96 304 96
WIRE 496 96 448 96
WIRE 624 96 576 96
WIRE 32 144 32 96
WIRE 160 144 160 96
WIRE 304 144 304 96
WIRE 32 288 32 224
WIRE 32 288 -48 288
WIRE 160 288 160 224
WIRE 160 288 32 288
WIRE 304 288 304 224
WIRE 624 288 304 288
WIRE 368 352 304 352
WIRE 496 352 448 352
WIRE 624 352 576 352
WIRE 304 400 304 352
WIRE 304 544 304 480
WIRE 624 544 304 544
FLAG 624 288 4
IOPIN 624 288 Out
FLAG 624 96 3
IOPIN 624 96 Out
FLAG -48 96 1
IOPIN -48 96 In
FLAG -48 288 2
IOPIN -48 288 In
FLAG 624 544 6
IOPIN 624 544 Out
FLAG 624 352 5
IOPIN 624 352 Out
SYMBOL bi 160 144 R0
WINDOW 0 45 39 Left 2
WINDOW 3 -320 182 Left 2
SYMATTR InstName B1
SYMATTR Value I=I(V1)*{ratio12}+I(V2)*{ratio13}
SYMBOL bv 304 128 R0
WINDOW 0 40 42 Left 2
WINDOW 3 40 70 Left 2
SYMATTR InstName B2
SYMATTR Value V=V(1,2)*{ratio12}
SYMBOL voltage 352 96 R270
WINDOW 0 32 56 VTop 2
WINDOW 3 -32 56 VBottom 2
WINDOW 123 0 0 Left 0
WINDOW 39 0 0 Left 0
SYMATTR InstName V1
SYMATTR Value 0
SYMBOL res 592 80 R90
WINDOW 0 0 56 VBottom 2
WINDOW 3 32 56 VTop 2
SYMATTR InstName R1
SYMATTR Value 1µ
SYMBOL res 16 128 R0
SYMATTR InstName R2
SYMATTR Value 1Meg
SYMBOL bv 304 384 R0
WINDOW 0 40 42 Left 2
WINDOW 3 40 70 Left 2
SYMATTR InstName B3
SYMATTR Value V=V(1,2)*{ratio13}
SYMBOL voltage 352 352 R270
WINDOW 0 32 56 VTop 2
WINDOW 3 -32 56 VBottom 2
WINDOW 123 0 0 Left 0
WINDOW 39 0 0 Left 0
SYMATTR InstName V2
SYMATTR Value 0
SYMBOL res 592 336 R90
WINDOW 0 0 56 VBottom 2
WINDOW 3 32 56 VTop 2
SYMATTR InstName R3
SYMATTR Value 1µ

optotof.asc, the sub-circuit schematic file:
Version 4
SHEET 1 892 680
WIRE -48 32 -128 32
WIRE 80 32 32 32
WIRE 384 32 224 32
WIRE 528 32 384 32
WIRE 624 32 528 32
WIRE 816 32 704 32
WIRE 80 80 80 32
WIRE 224 80 224 32
WIRE 384 80 384 32
WIRE 528 80 528 32
WIRE 80 208 80 160
WIRE 80 208 -128 208
WIRE 224 208 224 160
WIRE 384 208 384 144
WIRE 384 208 224 208
WIRE 528 208 528 144
WIRE 528 208 384 208
WIRE 816 208 528 208
FLAG -128 32 A
IOPIN -128 32 In
FLAG -128 208 K
IOPIN -128 208 In
FLAG 816 32 C
IOPIN 816 32 Out
FLAG 816 208 E
IOPIN 816 208 Out
SYMBOL f 224 80 R0
WINDOW 0 44 11 Left 2
WINDOW 3 40 47 Left 2
WINDOW 38 44 79 Left 2
SYMATTR InstName F1
SYMATTR Value {CTR}
SYMATTR SpiceModel Vf
SYMBOL res 48 16 R90
WINDOW 0 0 56 VBottom 2
WINDOW 3 32 56 VTop 2
SYMATTR InstName rd
SYMATTR Value {rd}
SYMBOL voltage 80 64 R0
WINDOW 0 47 46 Left 2
WINDOW 3 47 69 Left 2
WINDOW 123 0 0 Left 0
WINDOW 39 0 0 Left 0
SYMATTR InstName Vf
SYMATTR Value 1.05
SYMBOL voltage 720 32 R90
WINDOW 0 -32 56 VBottom 2
WINDOW 3 32 56 VTop 2
SYMATTR InstName V1
SYMATTR Value 100m
SYMBOL cap 368 80 R0
WINDOW 0 47 16 Left 2
WINDOW 3 46 43 Left 2
SYMATTR InstName C1
SYMATTR Value {Copto}
SYMBOL diode 512 144 M180
WINDOW 0 43 47 Left 2
WINDOW 3 44 21 Left 2
SYMATTR InstName D1
SYMATTR Value Dopto
TEXT -128 -96 Left 2 !.model Dopto D tt=100n Rs=10m N=100m\n.model DLED D N=1

The netlist it stands for:
* Flyback CM - QR - isolated - cbc - load step.asc
Lmag N006 N010 {Lp}
SW1 N013 d N012 0 TOFSW
rC N002 N007 10m
C2 N007 0 1m IC=0
Vin N005 0 311
Rlower N016 0 {Rlower}
Rupper Vout N016 {Rupper}
V6 N022 0 {Rlower}
V7 N021 0 {Rupper}
V8 N020 0 {RLED}
V9 N019 0 {Ccol}
V10 N018 0 {C1}
V13 N026 0 {fp}
V14 N025 0 {fz}
R5 N006 N005 10m
V3 N024 0 {fRHPZ}
Lf N010 d 2µ
D1 d N009 RR1VWM6S
R8 N005 N009 100k
C6 N005 N009 10n
D3 N013 d DBUCK
C7 d N013 150p
V2 N017 0 5
R7 FB N017 {Rpullup}
C3 FB 0 {Ccol}
R9 Vout N014 {RLED}
C4 N016 N015 {C1}
V5 N023 0 {Rmax}
D4 N001 N002 RB218NS150
R1 N013 0 {Ri}
R2 N013 CS 150
C1 CS 0 100p
R4 N008 DMG 22k
C5 0 DMG 15p
R6 N005 N011 10
C8 N011 d 470p
R10 Vout 0 {RL1}
R11 N003 Vout {RL2}
SW2 0 N003 N004 0 TOFSW
V1 N004 0 PWL(0 0 15m 0 15.001m 5 16.5m 5 16.501m 0)
V4 N002 Vout 0
X§X3 CS 0 0 FB N012 NC_01 DMG generic_cm_qr_pwm params: gain={gain} pole={pole} Isink={Isink} Isource={Isource} Vlow={VOL} Vhigh={VOH}
X§X2 N006 N010 N001 0 N008 0 xfmr_3w params: ratio12=-250m ratio13=-200m
X§X1 N014 N015 FB 0 optotof params: Copto={Copto} Rd={Rd} CTR={CTR}
X§X4 0 N016 N015 TL431TOF  ; pins A REF K

* block symbol definitions
.subckt generic_cm_qr_pwm CS FB GNDT CMP DRV DRVB DMG
A7 GNDT N007 GNDT N011 GNDT GNDT QDT GNDT AND Vhigh=5 Vlow=0 Ref=2.5
A8 N004 GNDT GNDT GNDT GNDT N010 N007 GNDT BUF Vhigh=5 Vlow=0 Ref=1.0
A9 N007 GNDT GNDT GNDT GNDT GNDT N011 GNDT BUF Vhigh=5 Vlow=0 Ref=2.5 Td={DT}
A10 GNDT N010 GNDT N015 GNDT GNDT QbDT GNDT AND Vhigh=5 Vlow=0 Ref=2.5
A11 N010 GNDT GNDT GNDT GNDT GNDT N015 GNDT BUF Vhigh=5 Vlow=0 Ref=2.5 Td={DT}
B3 N006 GNDT V=IF(V(QDT,GNDT)>2.5,{VDRV},100m)
B4 N016 GNDT V=IF(V(QbDT,GNDT)>2.5,{VDRV},100m)
R3 DRVB N016 10
C3 DRVB GNDT 10p
R4 DRV N006 10
C4 DRV GNDT 10p
X§X5 N017 FB GNDT CMP op_amp_fan_out params: gain={gain} pole={pole} Isink={Isink} Isource={Isource} Vlow={VOL} Vhigh={VOH}
V5 N017 GNDT {Vref}
B1 N018 GNDT V=IF(V(CMP,GNDT)/3>{VCS},{VCS},V(CMP,GNDT)/3)
V2 N014 GNDT 45m
D1 GNDT DMG BZX84B10VLY
SW1 CS N019 N022 GNDT TOFLEB
SW2 GNDT N019 N020 GNDT TOFLEB
A1 N020 GNDT GNDT GNDT GNDT N021 GNDT GNDT BUF Vhigh=5 Vlow=0 Ref=2.5
V1 N001 GNDT 3
I1 0 N003 25µ
C1 N003 GNDT 1n
SW3 GNDT N003 DRV GNDT TOFLEB
A2 GNDT N008 GNDT N002 GNDT GNDT N009 GNDT OR Vhigh=5 Vlow=0 Ref=2.5
X§X7 N001 N003 N002 GNDT comptof_g params: VHIGH=5 VLOW=100m VHYS=10m
X§X4 DMG N014 N012 GNDT comptof_g params: VHIGH=5 VLOW=100m VHYS=10m
X§X3 N018 N019 N013 GNDT comptof_g params: VHIGH=5 VLOW=100m VHYS=10m
X§X8 DRV GNDT N023 small_pulse_leb params: TLEB=150n
R1 N020 N023 100
C2 N020 GNDT 10p
R2 N022 N021 100
C5 N022 GNDT 10p
X§X1 N005 N012 N008 NC_01 GNDT N004 d_flipflop_g_rst
X§X2 N013 N009 N004 N005 GNDT sr_latch_g
*
.model TOFLEB SW (Ron=10 Roff=10Meg Vt=2 Vh=1)
*
* This is a 100-µs watchdog which
* starts the circuit in case the
* demag is missing (at start-up
* for instance).
.ends generic_cm_qr_pwm

.subckt op_amp_fan_out + - Masse OUT
G1 Masse N004 + - 100µ
R1 N004 Masse {GAIN/100u}
C1 N004 Masse {1/(6.28*(GAIN/100u)*POLE)}
D1 Masse N004 dopamp
E1 N005 Masse N004 Masse 1
D3 N005 N006 dopamp
I1 N006 Masse {ISINK/185}
Q1 Masse N006 N003 0 2N3906
V1 OUT N003 {VLOW-700m}
I2 N002 OUT {Isource}
D4 OUT N002 dopamp
V3 N001 Masse {VHIGH}
D2 N004 N002 dopamp
R2 N002 N001 10
*
.model dopamp D RS=1m VFWD=1m TT=10n Cjo=10p
*
.ends op_amp_fan_out

.subckt comptof_g INV NINV OUT G
B1 HYS NINV V=IF(V(out) > ({VHIGH}+{VLOW})/2,{VHYS},0)
B2 N001 G V=IF(V(HYS,INV)>0,{VHIGH},{VLOW})
R1 N001 OUT 10
C1 OUT G 10p
R2 INV G 1Meg
.ends comptof_g

.subckt small_pulse_leb IN GNDT OUT
A1 GNDT IN GNDT N001 GNDT GNDT OUT GNDT AND Vhigh=5 Vlow=100m Ref=2.5
A2 GNDT IN GNDT IN GNDT N001 GNDT GNDT AND Vhigh=5 Vlow=100m Ref=2.5 TD={TLEB}
* This subcircuit generates a single narrow pulse
* at the rising edge of the input
.ends small_pulse_leb

.subckt d_flipflop_g_rst D CLK Q Qb G RST
A1 G D G D G N004 G G AND Vhigh=5 Vlow=100m Ref=2.5 TD=10n
BQ1 N001 G V=If((V(R2,G)<2.5) & ((V(S2,G)>2.5) | (V(Qb,G)<2.5)),5,100m)
R1 Q N001 30
C1 Q G 100p IC=0
BQB1 N002 G V=If((V(R2,G)>2.5) | ((V(Q,G)<2.5) & (V(S2,G)<2.5)),5,100m)
R2 Qb N002 30
C2 Qb G 100p IC=5
BQ2 N006 G V=If((V(R1,G)<2.5) & ((V(S1,G)>2.5) | (V(Qb,G)<2.5)),5,100m)
R3 Q1 N006 100
C3 Q1 G 70p IC=0
BQB2 N007 G V=If((V(R1,G)>2.5) | ((V(Q1,G)<2.5) & (V(S1,G)<2.5)),5,100m)
R4 QB1 N007 100
C4 QB1 G 70p IC=5
A2 G D G N003 G G S1 G AND Vhigh=5 Vlow=100m Ref=2.5 TD=10n
A3 G N004 G N003 G G R1 G AND Vhigh=5 Vlow=100m Ref=2.5 TD=10n
A4 G Q1 G CLK G G S2 G AND Vhigh=5 Vlow=100m Ref=2.5 TD=10n
A5 G CLK G QB1 G G N005 G AND Vhigh=5 Vlow=100m Ref=2.5 TD=10n
A6 G CLK G CLK G N003 G G AND Vhigh=5 Vlow=100m Ref=2.5 TD=10n
A7 G N005 G RST G G R2 G OR Vhigh=5 Vlow=0 Ref=2.5
.tran 0 100u 0 20n uic
.ends d_flipflop_g_rst

.subckt sr_latch_g R S Q Qb G
BQ a G V=If((V(R,G)<2.5) & ((V(S,G)>2.5) | (V(Qb,G)<2.5)),5,100m)
R1 R G 1Meg
R2 S G 1Meg
R3 Q a 10
C1 Q G 10p IC=0
BQB b G V=If((V(R,G)>2.5) | ((V(Q,G)<2.5) & (V(S,G)<2.5)),5,100m)
R4 Qb b 10
C2 Qb G 10p IC=5
.ends sr_latch_g

.subckt xfmr_3w 1 2 3 4 5 6
B1 1 2 I=I(V1)*{ratio12}+I(V2)*{ratio13}
B2 N001 4 V=V(1,2)*{ratio12}
V1 N001 N002 0
R1 3 N002 1µ
R2 1 2 1Meg
B3 N003 6 V=V(1,2)*{ratio13}
V2 N003 N004 0
R3 5 N004 1µ
.ends xfmr_3w

.subckt optotof A K C E
F1 N002 E Vf {CTR}
rd N001 A {rd}
Vf N001 K 1.05
V1 C N002 100m
C1 N002 E {Copto}
D1 E N002 Dopto
.model Dopto D tt=100n Rs=10m N=100m
.model DLED D N=1
.ends optotof

.model D D
.lib standard.dio
.model NPN NPN
.model PNP PNP
.lib standard.bjt
*
.model DBUCK D TT=10n Rs=10m Cjo=120p N=0.6 BV=650
.model TOFSW SW (Ron=100m Roff=10Meg Vt=2 Vh=1)
.model DCLP D RS=10 VFWD=1m TT=10n
*
.tran 0 18m 14.5m 100n uic
;.op
.options abstol=1u vntol=1m reltol=0.01 gmin=100p
+method=gear
* * Run an operating point to obtain the dc labels (.op)
* * These dc labels are the values of the components:
* pV --> pF
* nV --> nF
* kV --> kOhms
* *
* If Ccol is negative, the opto pole is too low
*
.param Vin=120
.param Vout=19
.param Lp=240u
.param Ri=238m
.param N=250m
*
*
.param D={Vout/(Vout+N*Vin)} ; duty ratio calculation
.param fRHPZ={((1-D)**2*Rload/(D*Lp*N**2))/(2*pi)}
.param fcMAX={0.2*fRHPZ} ; maximum crossover frequency
*
*
.param Gfc=-13.5 ; magnitude at crossover
.param PS=-85 ; phase lag at crossover
*
* Enter Design Goals Information Here *
*
.param fc=1k ; targeted crossover
.param PM=60 ; choose phase margin at crossover
*
* Enter the Values for Vout and Bridge Bias Current *
*
.param Ibias=250u
.param Rlower={Vref/Ibias}
.param Rupper={(Vout-Vref)/Ibias}
*
* Optocoupler specifications *
*
.param Rpullup=20k ; check with the selected control chip
.param Fopto=6k
.param Copto={1/(2*pi*Fopto*Rpullup)}
.param CTR=0.33
.param Rd=100 ; this is the LED dynamic resistance, depends on FB current
*
.param VL=0.2
.param VCEsat=0.3
.param Vdd=5
.param Vf=1
.param A={Vout-Vf-VL}
.param B={Vdd-VCEsat}
.param Rmax={(A/B)*Rpullup*CTR} ; check RLED is below Rmax
*
* Do not edit the below lines *
*
.param boost={PM-PS-90}
.param fp={(tan(boost*pi/180)+sqrt((tan(boost*pi/180))**2+1))*fc}
.param fz={fc**2/fp}
.param G={10**(-Gfc/20)}
.param RLED={CTR*Rpullup/G}
.param C1={1/(2*pi*fz*Rupper)}
.param C2={1/(2*pi*fp*Rpullup)}
.param Ccol={C2-Copto}
*
*
*
.param AOL=90
.param GAIN={10**(AOL/20)}
.param pole=30
.param Isink=20m
.param Isource=500u
.param VOL=100m
.param VOH=3
*
.param Vref=2.5
.param Tss=5m
*
*
.param Dutymax=0.8
.param DT=50n
.param VDRV=12
.param VCS=1
*
*
.param P=65
.param step=50 ; if step=30, then load is first 70% then goes 100%
.param RL1={Vout**2/(P*(1-step/100))} ; first load
.param RL2={Vout**2/(P*(step/100))} ; final load
.param Rload={Vout**2/P} ; nominal 100% load
*
.backanno
.end